# EAGLE design prescaled_trigger (EAGLE 6.5.0)
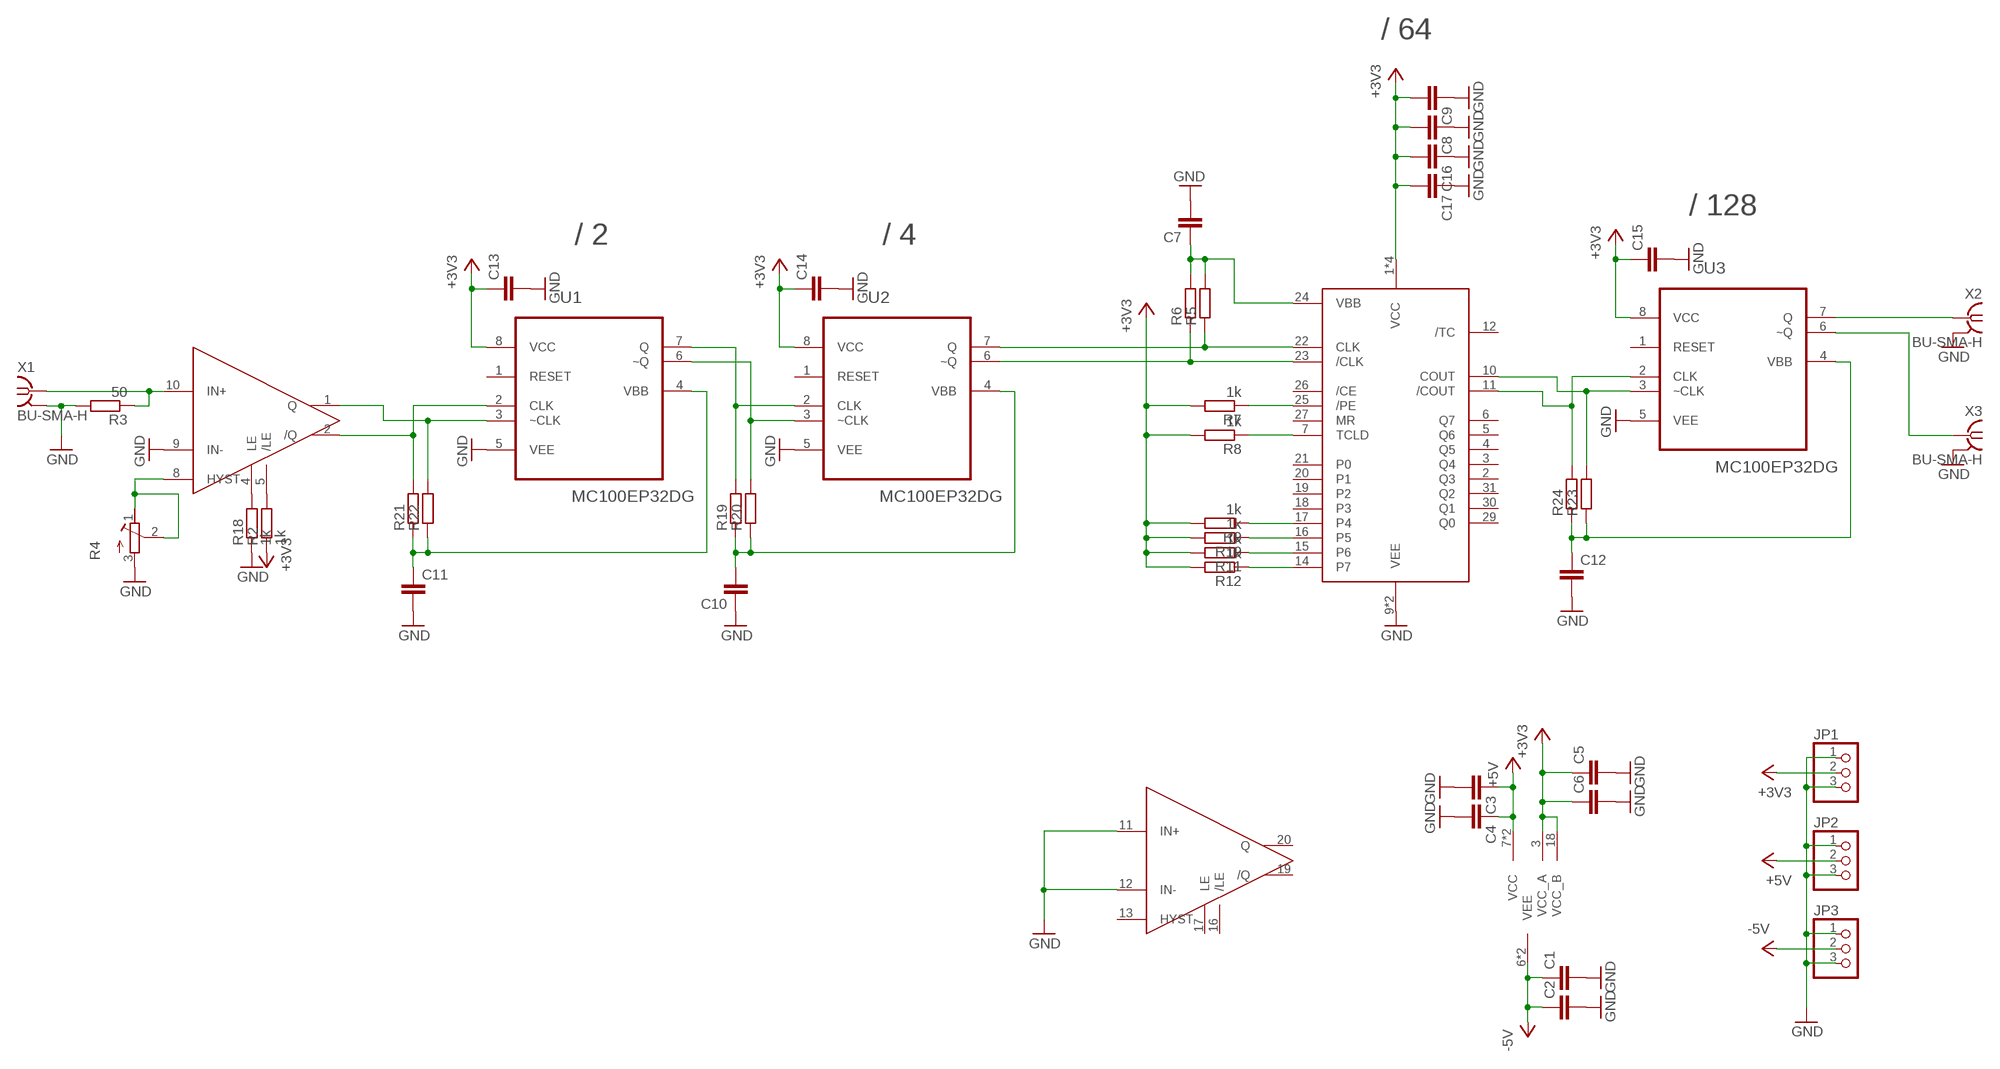
[diagram p0: schematic, sheet 1]

## Parts
C1  C-EUC0805  [C0805]
C2  C-EUC0805  [C0805]
C3  C-EUC0805  [C0805]
C4  C-EUC0805  [C0805]
C5  C-EUC0805  [C0805]
C6  C-EUC0805  [C0805]
C7  C-EUC0805  [C0805]
C8  C-EUC0805  [C0805]
C9  C-EUC0805  [C0805]
C10  C-EUC0805  [C0805]
C11  C-EUC0805  [C0805]
C12  C-EUC0805  [C0805]
C13  C-EUC0805  [C0805]
C14  C-EUC0805  [C0805]
C15  C-EUC0805  [C0805]
C16  C-EUC0805  [C0805]
C17  C-EUC0805  [C0805]
JP1  PINHD-1X3  [1X03]
JP2  PINHD-1X3  [1X03]
JP3  PINHD-1X3  [1X03]
R2  1k  R-EU_M0805  [M0805]
R3  50  R-EU_M0805  [M0805]
R4  R-TRIMMT18  [RTRIMT18]
R5  R-EU_M1206  [M1206]
R6  R-EU_M1206  [M1206]
R7  1k  R-EU_M0805  [M0805]
R8  1k  R-EU_M0805  [M0805]
R9  1k  R-EU_M0805  [M0805]
R10  1k  R-EU_M0805  [M0805]
R11  1k  R-EU_M0805  [M0805]
R12  1k  R-EU_M0805  [M0805]
R18  1k  R-EU_M0805  [M0805]
R19  R-EU_M1206  [M1206]
R20  R-EU_M1206  [M1206]
R21  R-EU_M1206  [M1206]
R22  R-EU_M1206  [M1206]
R23  R-EU_M1206  [M1206]
R24  R-EU_M1206  [M1206]
U1  MC100EP32DG  [SOIC127P600X175-8N]
U2  MC100EP32DG  [SOIC127P600X175-8N]
U3  MC100EP32DG  [SOIC127P600X175-8N]
U$1  MAX9601  [SSOP20DB]
U$2  MC100EP016  [QFP80P900X900X160-32N]
X1  BU-SMA-H  [BU-SMA-H]
X2  BU-SMA-H  [BU-SMA-H]
X3  BU-SMA-H  [BU-SMA-H]

## Nets
+3V3: C5.1 C6.1 C8.2 C9.2 C13.1 C14.1 C15.1 C16.2 C17.2 JP1.2 R2.1 R7.2 R8.2 R9.2 R10.2 R11.2 R12.2 U1.8(VCC) U2.8(VCC) U3.8(VCC) U$1.3(VCC_A) U$1.18(VCC_B) U$2.1(VCC) U$2.8(VCC) U$2.13(VCC) U$2.32(VCC)
+5V: C3.1 C4.1 JP2.2 U$1.7(VCC) U$1.14(VCC)
-5V: C1.1 C2.1 JP3.2 U$1.6(VEE) U$1.15(VEE)
/CLKIN: R6.1 U2.6(~Q) U$2.23(/CLK)
CLKIN: R5.1 U2.7(Q) U$2.22(CLK)
GND: C1.2 C2.2 C3.2 C4.2 C5.2 C6.2 C7.2 C8.1 C9.1 C10.1 C11.2 C12.2 C13.2 C14.2 C15.2 C16.1 C17.1 JP1.1 JP1.3 JP2.1 JP2.3 JP3.1 JP3.3 R3.2 R4.3(E) R18.1 U1.5(VEE) U2.5(VEE) U3.5(VEE) U$1.9(IN-) U$1.11(IN+) U$1.12(IN-) U$2.9(VEE) U$2.28(VEE) X1.2 X1.3 X1.4 X1.5 X2.2 X2.3 X2.4 X2.5 X3.2 X3.3 X3.4 X3.5
N$2: R2.2 U$1.5(/LE)
N$3: R11.1 U$2.15(P6)
N$4: R4.1(A) R4.2(S) U$1.8(HYST)
N$5: R10.1 U$2.16(P5)
N$6: R9.1 U$2.17(P4)
N$7: R12.1 U$2.14(P7)
N$10: R8.1 U$2.7(TCLD)
N$11: R7.1 U$2.25(/PE)
N$15: R18.2 U$1.4(LE)
N$16: C11.1 R21.1 R22.1 U1.4(VBB)
N$17: R21.2 U1.2(CLK) U$1.2(/Q)
N$18: R22.2 U1.3(~CLK) U$1.1(Q)
N$19: C10.2 R19.1 R20.1 U2.4(VBB)
N$20: R19.2 U1.7(Q) U2.2(CLK)
N$21: R20.2 U1.6(~Q) U2.3(~CLK)
N$26: U3.7(Q) X2.1
N$27: U3.6(~Q) X3.1
N$28: C12.1 R23.1 R24.1 U3.4(VBB)
N$29: R24.2 U3.2(CLK) U$2.11(/COUT)
N$30: R23.2 U3.3(~CLK) U$2.10(COUT)
RFIN: R3.1 U$1.10(IN+) X1.1
VBB: C7.1 R5.2 R6.2 U$2.24(VBB)
Unconnected: U1.1(RESET) U2.1(RESET) U3.1(RESET) U$1.13(HYST) U$1.16(/LE) U$1.17(LE) U$1.19(/Q) U$1.20(Q) U$2.2(Q3) U$2.3(Q4) U$2.4(Q5) U$2.5(Q6) U$2.6(Q7) U$2.12(/TC) U$2.18(P3) U$2.19(P2) U$2.20(P1) U$2.21(P0) U$2.26(/CE) U$2.27(MR) U$2.29(Q0) U$2.30(Q1) U$2.31(Q2)

## Notes on the sheet
- / 64
- / 128
- / 2 | / 4

## Library data of the parts
C1-C17 = resistor:C-EU: CAPACITOR, European symbol
JP1-JP3 = pinhead:PINHD-1X3: PIN HEADER
R2 R3 R5-R12 R18-R24 = resistor:R-EU_: RESISTOR, European symbol
R4 = resistor:R-TRIMM: Trimm resistor
U1-U3 = MC100EP32:MC100EP32DG: 3.3V / 5V ECL /2 Divider; MPN: MC100EP32DG; OC_FARNELL: 1607663; OC_NEWARK: 42K0424; PACKAGE: SOIC-8; SUPPLIER: ON Semiconductor
U$1 = MAX9601:MAX9601
U$2 = MC100EP016:MC100EP016
X1-X3 = con-coax:BU-SMA-H: FEMALE SMA CONNECTOR Radiall; OC_FARNELL: unknown; OC_NEWARK: unknown

## Board
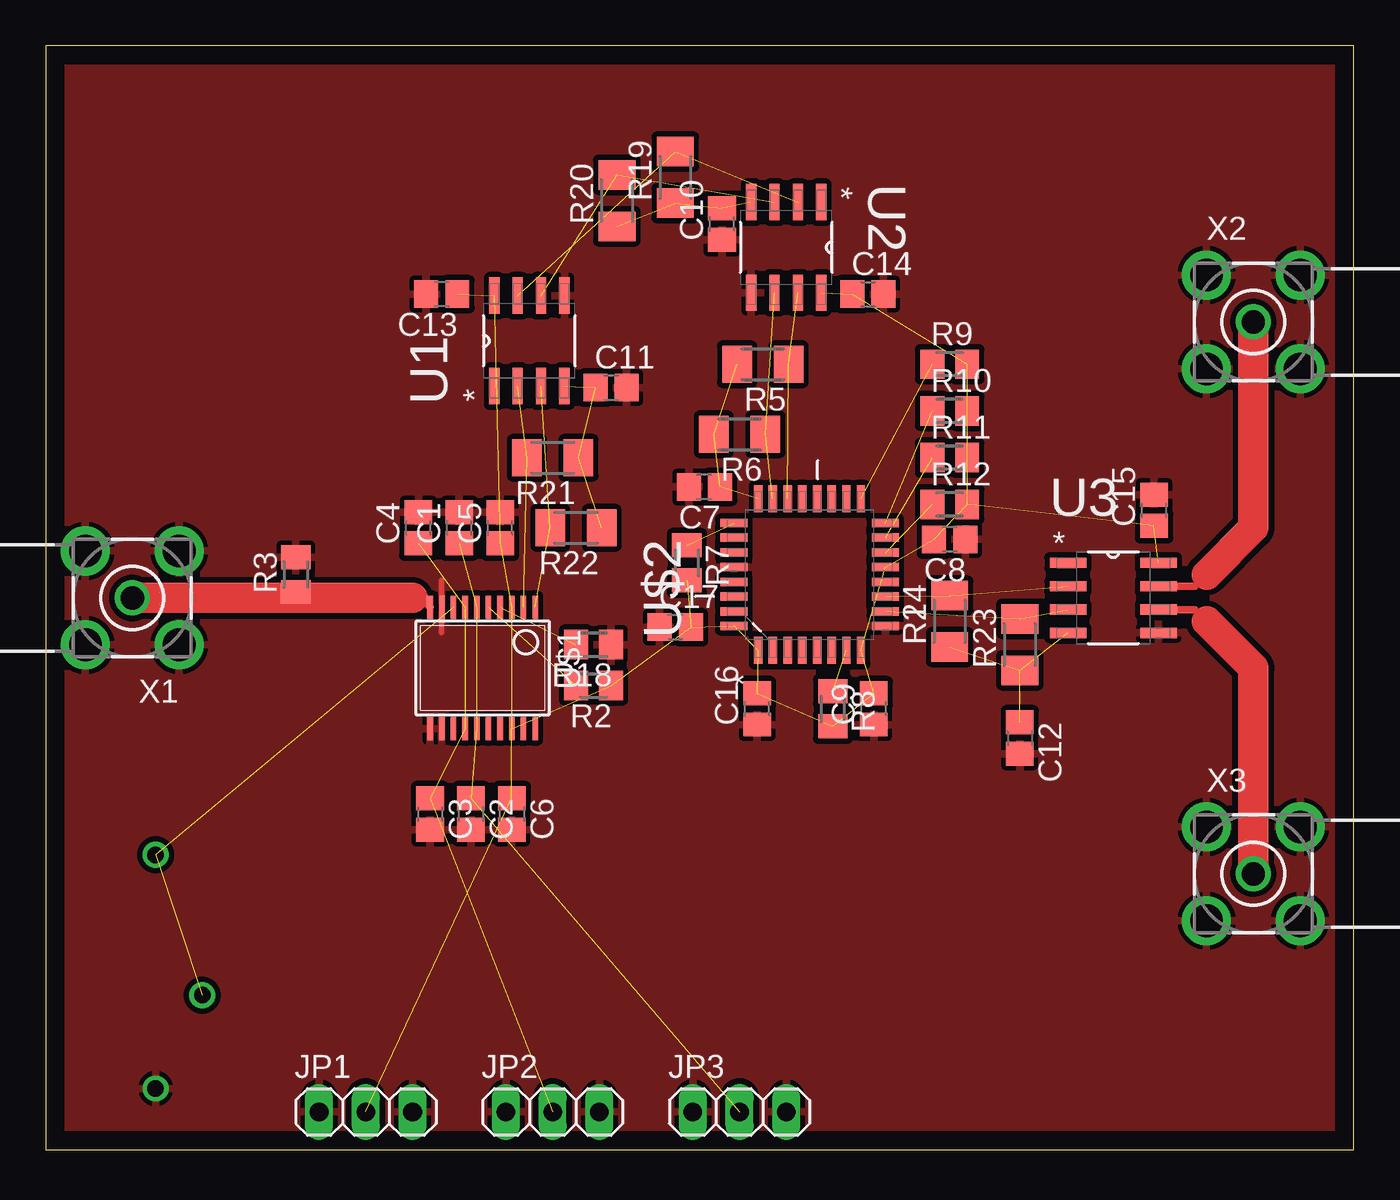
[diagram p1: board, top side]
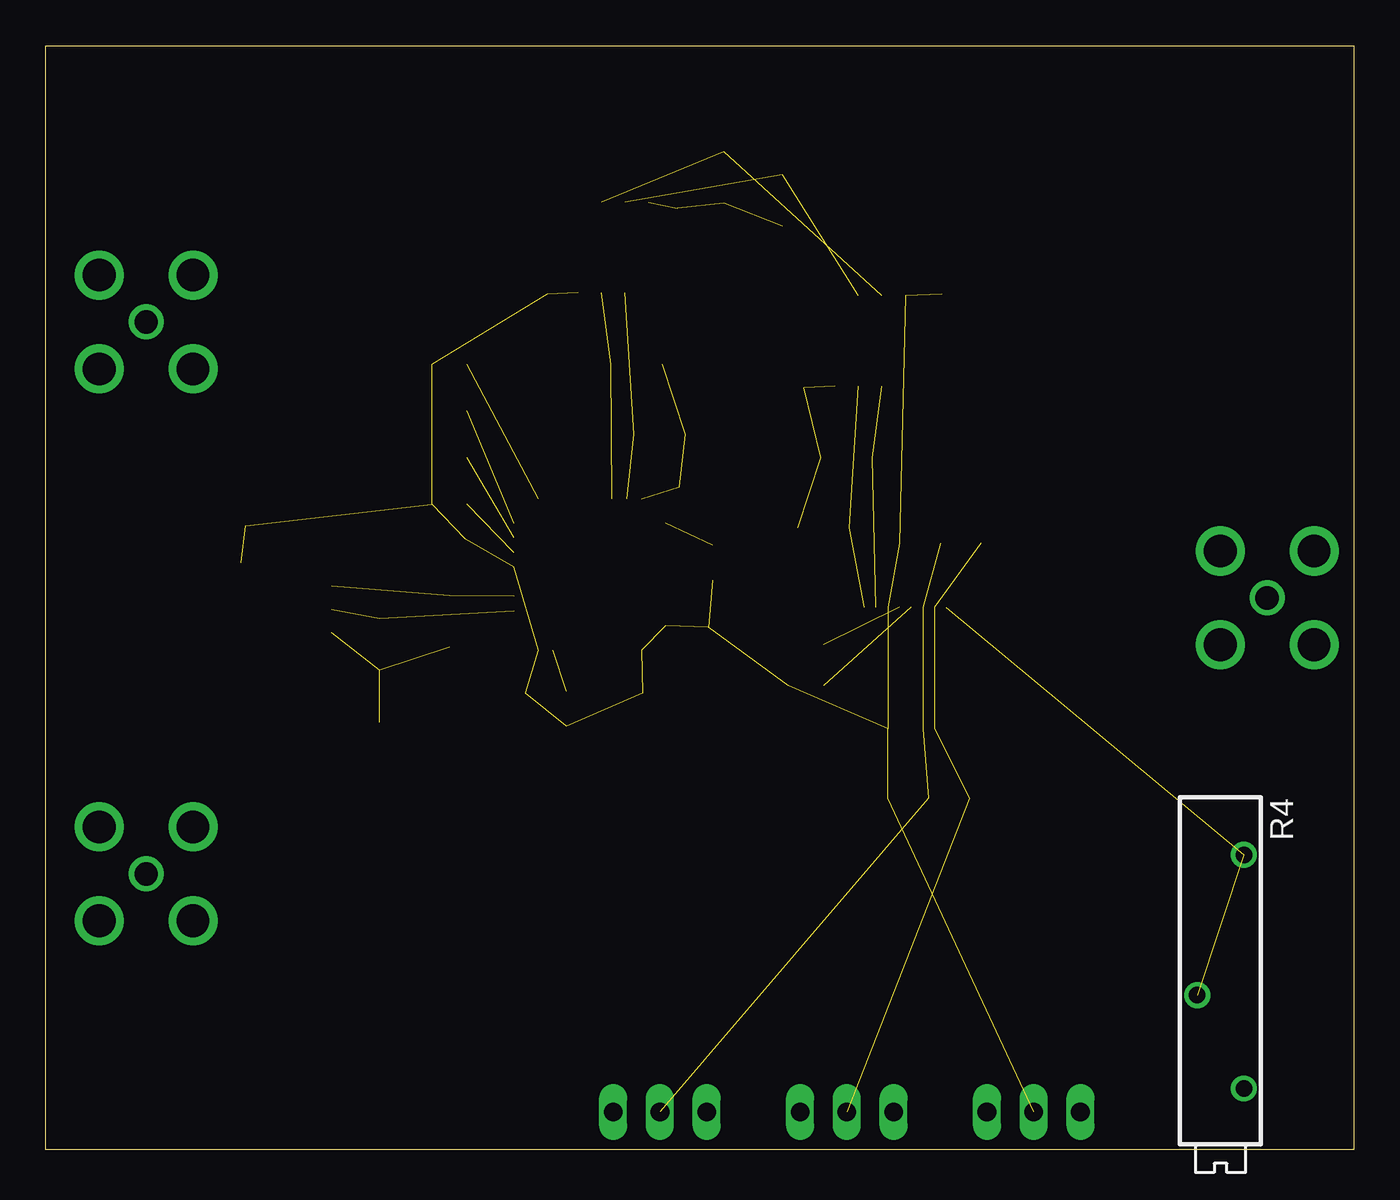
[diagram p2: board, bottom side, seen from below]

Size 71.1 x 60 mm. Coordinates in mm from the lower left corner, seen from the top.
Outline: 0,0 71.1,0 71.1,60 0,60 0,0
Copper layers (1*16): Top 0.035mm / dielectric 1.5mm / Bottom 0.035mm
Design rules "default": minimum track width 10mil, minimum drill 24mil, track to track 8mil, track to pad 8mil, pad to pad 8mil, via to via 8mil, smd to smd 8mil, copper to edge 40mil, drill to drill 8mil, minimum pad ring 10mil, minimum via ring 8mil, stop-mask expansion 4mil, vias tented up to drill 0mil, thermal gap 10mil

### Footprints (pad centres in the part's own frame; a part is rotated, then mirrored left to right if it is on the bottom)
C0805 = smd 1.3 x 1.5: 1 -0.85,0; 2 0.85,0
1X03 = drill 1.016 long: 1 -2.54,0; 2 0,0; 3 2.54,0
M0805 = smd 1.3 x 1.6: 1 -0.95,0; 2 0.95,0
RTRIMT18 = drill 0.9: 1 -7.62,1.27; 2 0,-1.27; 3 5.08,1.27
M1206 = smd 1.6 x 2: 1 -1.4,0; 2 1.4,0
SOIC127P600X175-8N = smd 1.981 x 0.559: 1 -2.464,1.905; 2 -2.464,0.635; 3 -2.464,-0.635; 4 -2.464,-1.905; 5 2.464,-1.905; 6 2.464,-0.635; 7 2.464,0.635; 8 2.464,1.905
SSOP20DB = smd 0.305 x 1.245: 1 -2.857,-3.302; 2 -2.222,-3.302; 3 -1.587,-3.302; 4 -0.952,-3.302; 5 -0.317,-3.302; 6 0.318,-3.302; 7 0.953,-3.302; 8 1.588,-3.302; 9 2.223,-3.302; 10 2.858,-3.302; 11 2.858,3.302; 12 2.223,3.302; 13 1.588,3.302; 14 0.953,3.302; 15 0.318,3.302; 16 -0.317,3.302; 17 -0.952,3.302; 18 -1.587,3.302; 19 -2.222,3.302; 20 -2.857,3.302
QFP80P900X900X160-32N = smd 1.473 x 0.457: 1 -4.115,2.794; 2 -4.115,2.007; 3 -4.115,1.194; 4 -4.115,0.406; 5 -4.115,-0.406; 6 -4.115,-1.194; 7 -4.115,-2.007; 8 -4.115,-2.794; 17 4.115,-2.794; 18 4.115,-2.007; 19 4.115,-1.194; 20 4.115,-0.406; 21 4.115,0.406; 22 4.115,1.194; 23 4.115,2.007; 24 4.115,2.794 | smd 0.457 x 1.473: 9 -2.794,-4.115; 10 -2.007,-4.115; 11 -1.194,-4.115; 12 -0.406,-4.115; 13 0.406,-4.115; 14 1.194,-4.115; 15 2.007,-4.115; 16 2.794,-4.115; 25 2.794,4.115; 26 2.007,4.115; 27 1.194,4.115; 28 0.406,4.115; 29 -0.406,4.115; 30 -1.194,4.115; 31 -2.007,4.115; 32 -2.794,4.115
BU-SMA-H = drill 1.27: 1 0,0 | drill 1.778: 2 -2.55,2.55; 3 2.55,2.55; 4 2.55,-2.55; 5 -2.55,-2.55

### Placement (x,y rotation side)
C1  22.47,33.81 90 top
C2  23.11,18.25 270 top
C3  20.89,18.25 270 top
C4  20.25,33.81 90 top
C5  24.7,33.81 90 top
C6  25.33,18.25 270 top
C7  35.81,36.03 180 top
C8  49.14,33.17 180 top
C9  45.02,23.97 90 top
C10  36.76,50.32 90 top
C11  30.73,41.43 0 top
C12  52.95,22.38 270 top
C13  21.52,46.51 180 top
C14  44.7,46.51 0 top
C15  60.26,34.76 90 top
C16  38.67,23.97 90 top
C17  34.22,28.41 0 top
JP1  17.39,2.06 0 top
JP2  27.55,2.06 0 top
JP3  37.71,2.06 0 top
R2  29.78,25.24 180 top
R3  13.58,31.27 90 top
R4  7.23,8.41 270 bottom
R5  38.98,42.7 180 top
R6  37.71,38.89 180 top
R7  34.86,31.91 270 top
R8  42.79,23.97 270 top
R9  49.14,42.7 0 top
R10  49.14,40.16 0 top
R11  49.14,37.62 0 top
R12  49.14,35.08 0 top
R18  29.78,27.46 180 top
R19  34.22,52.86 90 top
R20  31.05,51.59 90 top
R21  27.55,37.62 180 top
R22  28.82,33.81 180 top
R23  52.95,27.46 90 top
R24  49.14,28.73 90 top
U1  26.28,43.97 90 top
U2  40.25,49.05 270 top
U3  58.03,30 0 top
U$1  23.74,26.19 180 top
U$2  41.52,31.27 90 top
X1  4.69,30 180 top
X2  65.65,45 0 top
X3  65.65,15 0 top

### Tracks (layer width: path | path; a pad name or v marks a point on that pad's centre or on a via)
+3V3  (25 unrouted)
+5V  (4 unrouted)
-5V  (4 unrouted)
/CLKIN  (2 unrouted)
CLKIN  (2 unrouted)
GND
  Top 0.305: U$1.9 | U$1.9 21.52,30.95 | U$1.9 21.52,28.09
  pour Top (isolate 0.305, rank 6): -0.39,-0.48 72,-0.48 72,60.48 -0.39,60.48
N$2  (1 unrouted)
N$3  (1 unrouted)
N$4  (2 unrouted)
N$5  (1 unrouted)
N$6  (1 unrouted)
N$7  (1 unrouted)
N$10  (1 unrouted)
N$11  (1 unrouted)
N$15  (1 unrouted)
N$16  (3 unrouted)
N$17  (2 unrouted)
N$18  (2 unrouted)
N$19  (3 unrouted)
N$20  (2 unrouted)
N$21  (2 unrouted)
N$26
  Top 0.406: U3.7 62.48,30.64 63.11,31.27
  Top 1.67: X2.1 65.65,33.81 63.11,31.27
N$27
  Top 0.406: U3.6 62.48,29.36 63.11,28.73
  Top 1.67: X3.1 65.65,26.19 63.11,28.73
N$28  (3 unrouted)
N$29  (2 unrouted)
N$30  (2 unrouted)
RFIN
  Top 0.406: U$1.10 20.38,30 19.93,30 19.61,30.32 R3.1
  Top 1.67: X1.1 19.93,30
VBB  (3 unrouted)